# EAGLE design Fortin33 (EAGLE 9.4.2)
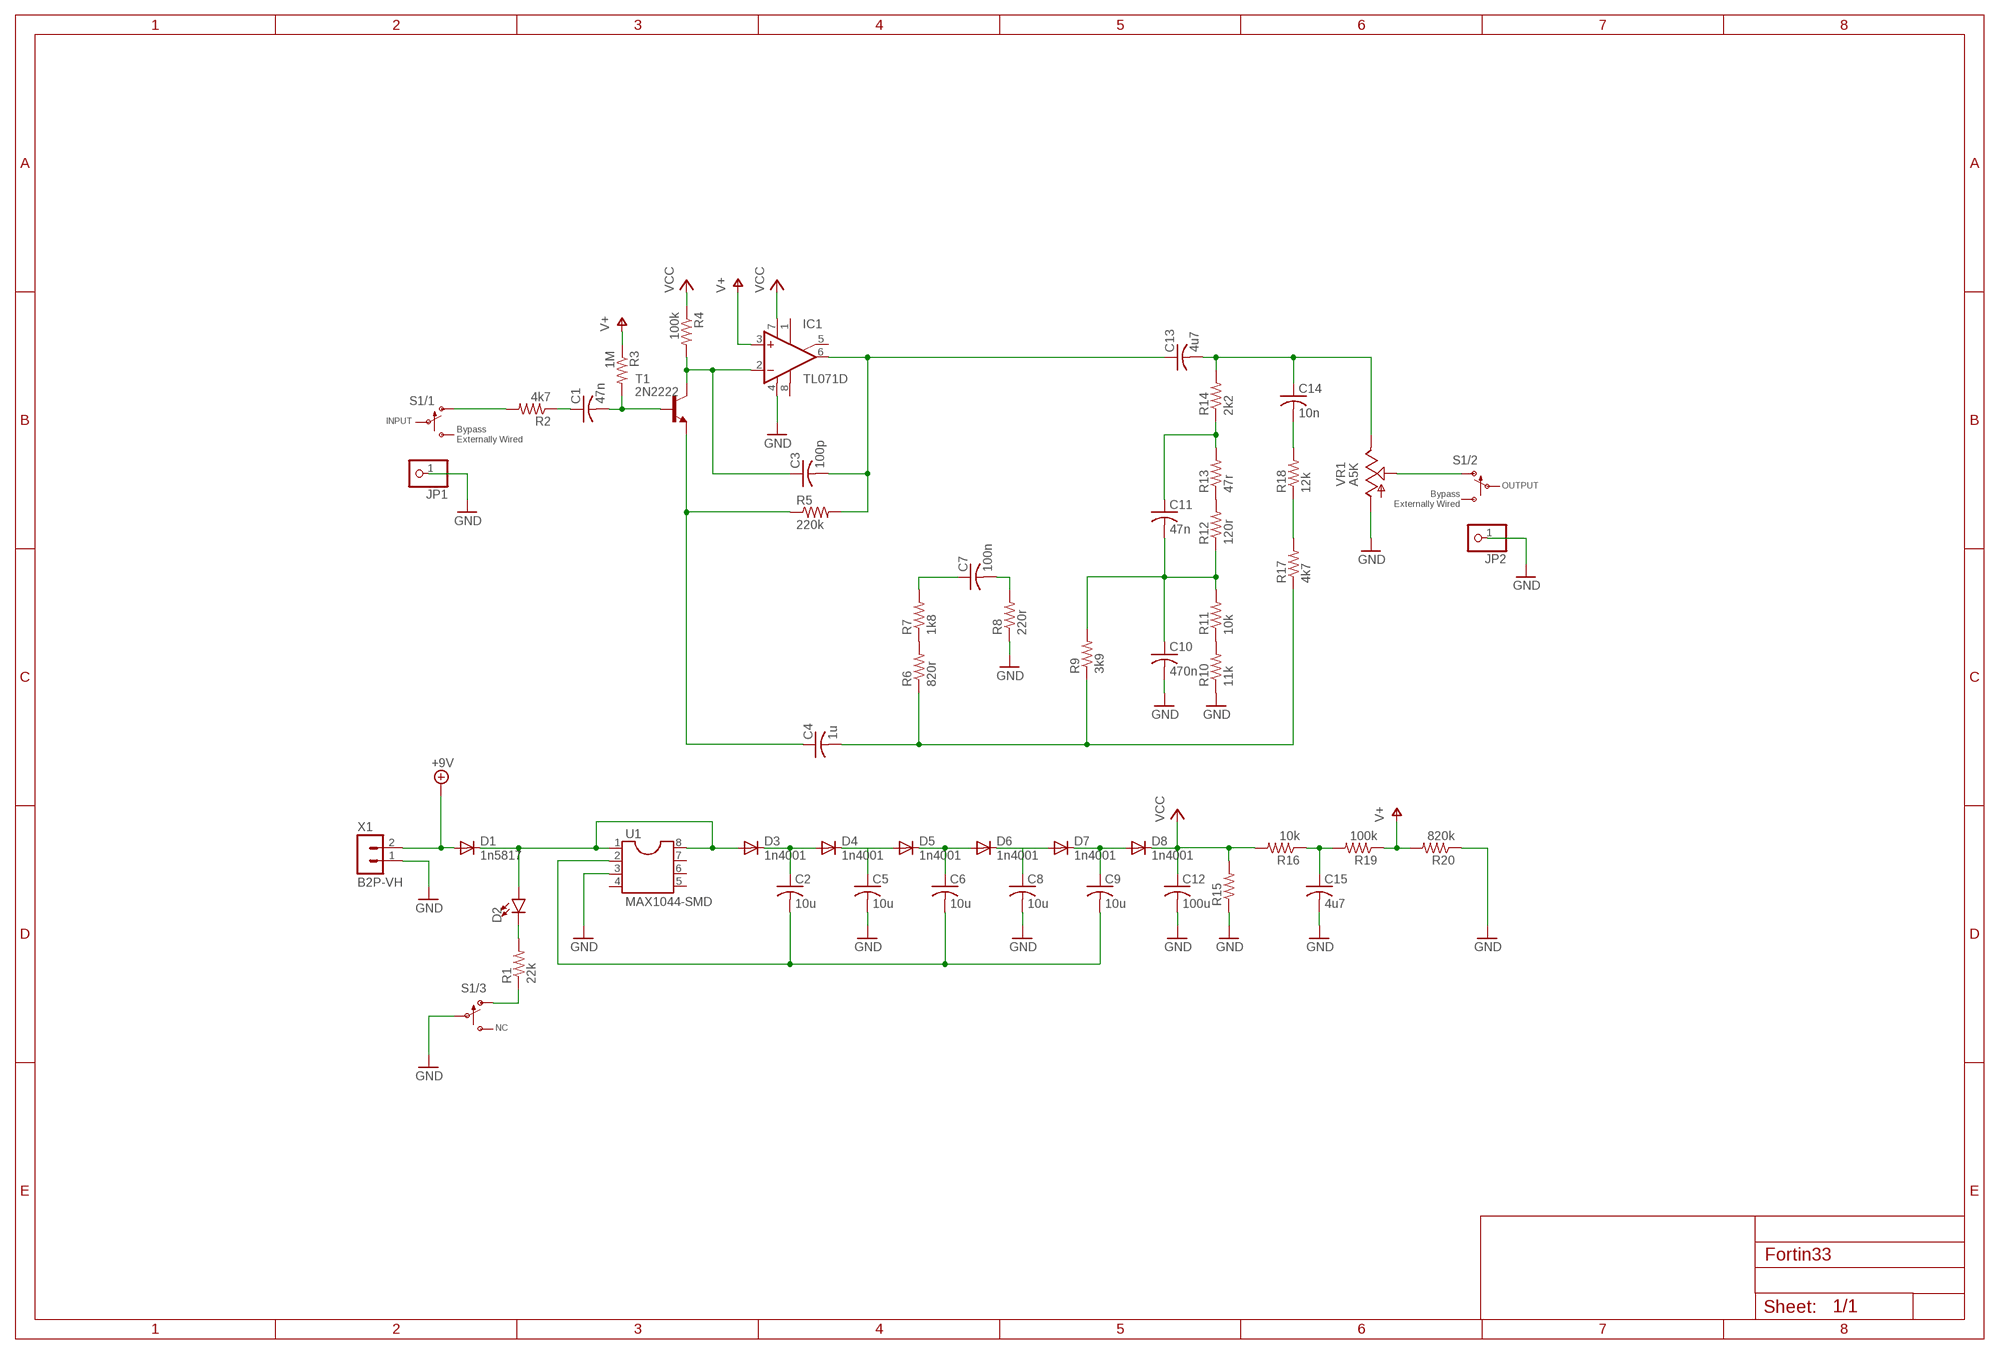
[diagram p0: schematic, sheet 1]

## Parts
C1  47n  C-USC0603  [C0603]
C2  10u  C-US050-025X075  [C050-025X075]
C3  100p  C-USC0603  [C0603]
C4  1u  C-USC0603  [C0603]
C5  10u  C-US050-025X075  [C050-025X075]
C6  10u  C-US050-025X075  [C050-025X075]
C7  100n  C-USC0603  [C0603]
C8  10u  C-US050-025X075  [C050-025X075]
C9  10u  C-US050-025X075  [C050-025X075]
C10  470n  C-USC0603  [C0603]
C11  47n  C-USC0603  [C0603]
C12  100u  C-US075-063X106  [C075-063X106]
C13  4u7  C-USC0603  [C0603]
C14  10n  C-USC0603  [C0603]
C15  4u7  C-US050-025X075  [C050-025X075]
D1  1n5817  1N4004  [DO41-10]
D2  LED3MM  [LED_3MM]
D3  1n4001  1N4004  [DO41-10]
D4  1n4001  1N4004  [DO41-10]
D5  1n4001  1N4004  [DO41-10]
D6  1n4001  1N4004  [DO41-10]
D7  1n4001  1N4004  [DO41-10]
D8  1n4001  1N4004  [DO41-10]
IC1  TL071D  [SO08]
JP1  PINHD-1X1  [1X01]
JP2  PINHD-1X1  [1X01]
R1  22k  R-US_R0603  [R0603]
R2  4k7  R-US_R0603  [R0603]
R3  1M  R-US_R0603  [R0603]
R4  100k  R-US_R0603  [R0603]
R5  220k  R-US_R0603  [R0603]
R6  820r  R-US_R0603  [R0603]
R7  1k8  R-US_R0603  [R0603]
R8  220r  R-US_R0603  [R0603]
R9  3k9  R-US_R0603  [R0603]
R10  11k  R-US_R0603  [R0603]
R11  10k  R-US_R0603  [R0603]
R12  120r  R-US_R0603  [R0603]
R13  47r  R-US_R0603  [R0603]
R14  2k2  R-US_R0603  [R0603]
R15  R-US_R0603  [R0603]
R16  10k  R-US_R0603  [R0603]
R17  4k7  R-US_R0603  [R0603]
R18  12k  R-US_R0603  [R0603]
R19  100k  R-US_R0603  [R0603]
R20  820k  R-US_R0603  [R0603]
S1  SWITCH-3DPT-INLINE-BREAKOUT-BYPASS  [1X04]
T1  2N2222  [TO92-EBC-OVAL]
U1  MAX1044-SMD  [SO-08]
VR1  A5K  16MM-POT  [ALPHA-16-MINI]
X1  B2P-VH  [B2P-VH]

## Nets
+9V: D1.A X1.2
GND: C5.2 C8.2 C10.2 C12.2 C15.2 IC1.4(V-) JP1.1 JP2.1 R8.1 R10.1 R15.1 R20.1 S1.3(/3:COMMON) U1.3 VR1.LEFT X1.1
N$1: S1.2(/2:NORMALLY-ON) VR1.WIPER
N$3: C1.1 R2.1
N$4: R2.2 S1.1(/1:NORMALLY-ON)
N$6: C3.1 IC1.2(-IN) R4.2 T1.C
N$7: C1.2 R3.2 T1.B
N$10: R12.2 R13.1
N$11: C3.2 C13.1 IC1.6(OUT) R5.2
N$12: C4.1 R5.1 T1.E
N$13: C11.1 R13.2 R14.1
N$14: C13.2 C14.1 R14.2 VR1.RIGHT
N$15: C10.1 C11.2 R9.2 R11.2 R12.1
N$16: R10.2 R11.1
N$17: R6.2 R7.1
N$18: C7.1 R7.2
N$19: C7.2 R8.2
N$20: C4.2 R6.1 R9.1 R17.1
N$21: R17.2 R18.1
N$22: C14.2 R18.2
N$24: D1.C D2.A D3.A U1.1 U1.8
N$25: D2.K(C) R1.2
N$26: R1.1 S1.4(/3:NORMALLY-ON)
N$27: C2.2 C6.2 C9.2 U1.2
N$28: C2.1 D3.C D4.A
N$29: C5.1 D4.C D5.A
N$33: C6.1 D5.C D6.A
N$35: C8.1 D6.C D7.A
N$37: C9.1 D7.C D8.A
N$40: C15.1 R16.1 R19.2
V+: IC1.3(+IN) R3.1 R19.1 R20.2
VCC: C12.1 D8.C IC1.7(V+) R4.1 R15.2 R16.2
Unconnected: IC1.1(ON1) IC1.5(ON2) IC1.8(OPT) U1.4 U1.5 U1.6 U1.7

## Library data of the parts
C1-C15 = rcl:C-US: CAPACITOR, American symbol; SPICEPREFIX: C
D1 D3-D8 = adafruit:1N4004: DIODE General purpose 1N400x type rectifier (With bigger pads) http://www.ladyada.net/library/pcb/eaglelibrary.html
D2 = SparkFun-LED:LED: LED (Generic) Standard schematic elements and footprints for 5mm, 3mm, 1206, and 0603 sized LEDs. Generic LEDs with no color specified.; PROD_ID: DIO-08794
IC1 = linear:TL071: OP AMP
JP1 JP2 = adafruit:PINHD-1X1: Pin header 1x1 for 0.1" spacing With round pins
R1-R20 = rcl:R-US_: RESISTOR, American symbol; SPICEPREFIX: R
S1 = pedalPartsLibrary:SWITCH-3DPT-INLINE-BREAKOUT-BYPASS
T1 = adafruit:2N2222: NPN TRANSISTOR Big oval pads
U1 = pedalPartsLibrary:MAX1044-SMD
VR1 = pedalPartsLibrary:16MM-POT
X1 = con-JST VH:B2P-VH: JST VH Series header 3.96mm pitch disconnectable crimp style connectors, vertical (side entry type), 2 pins

## Board
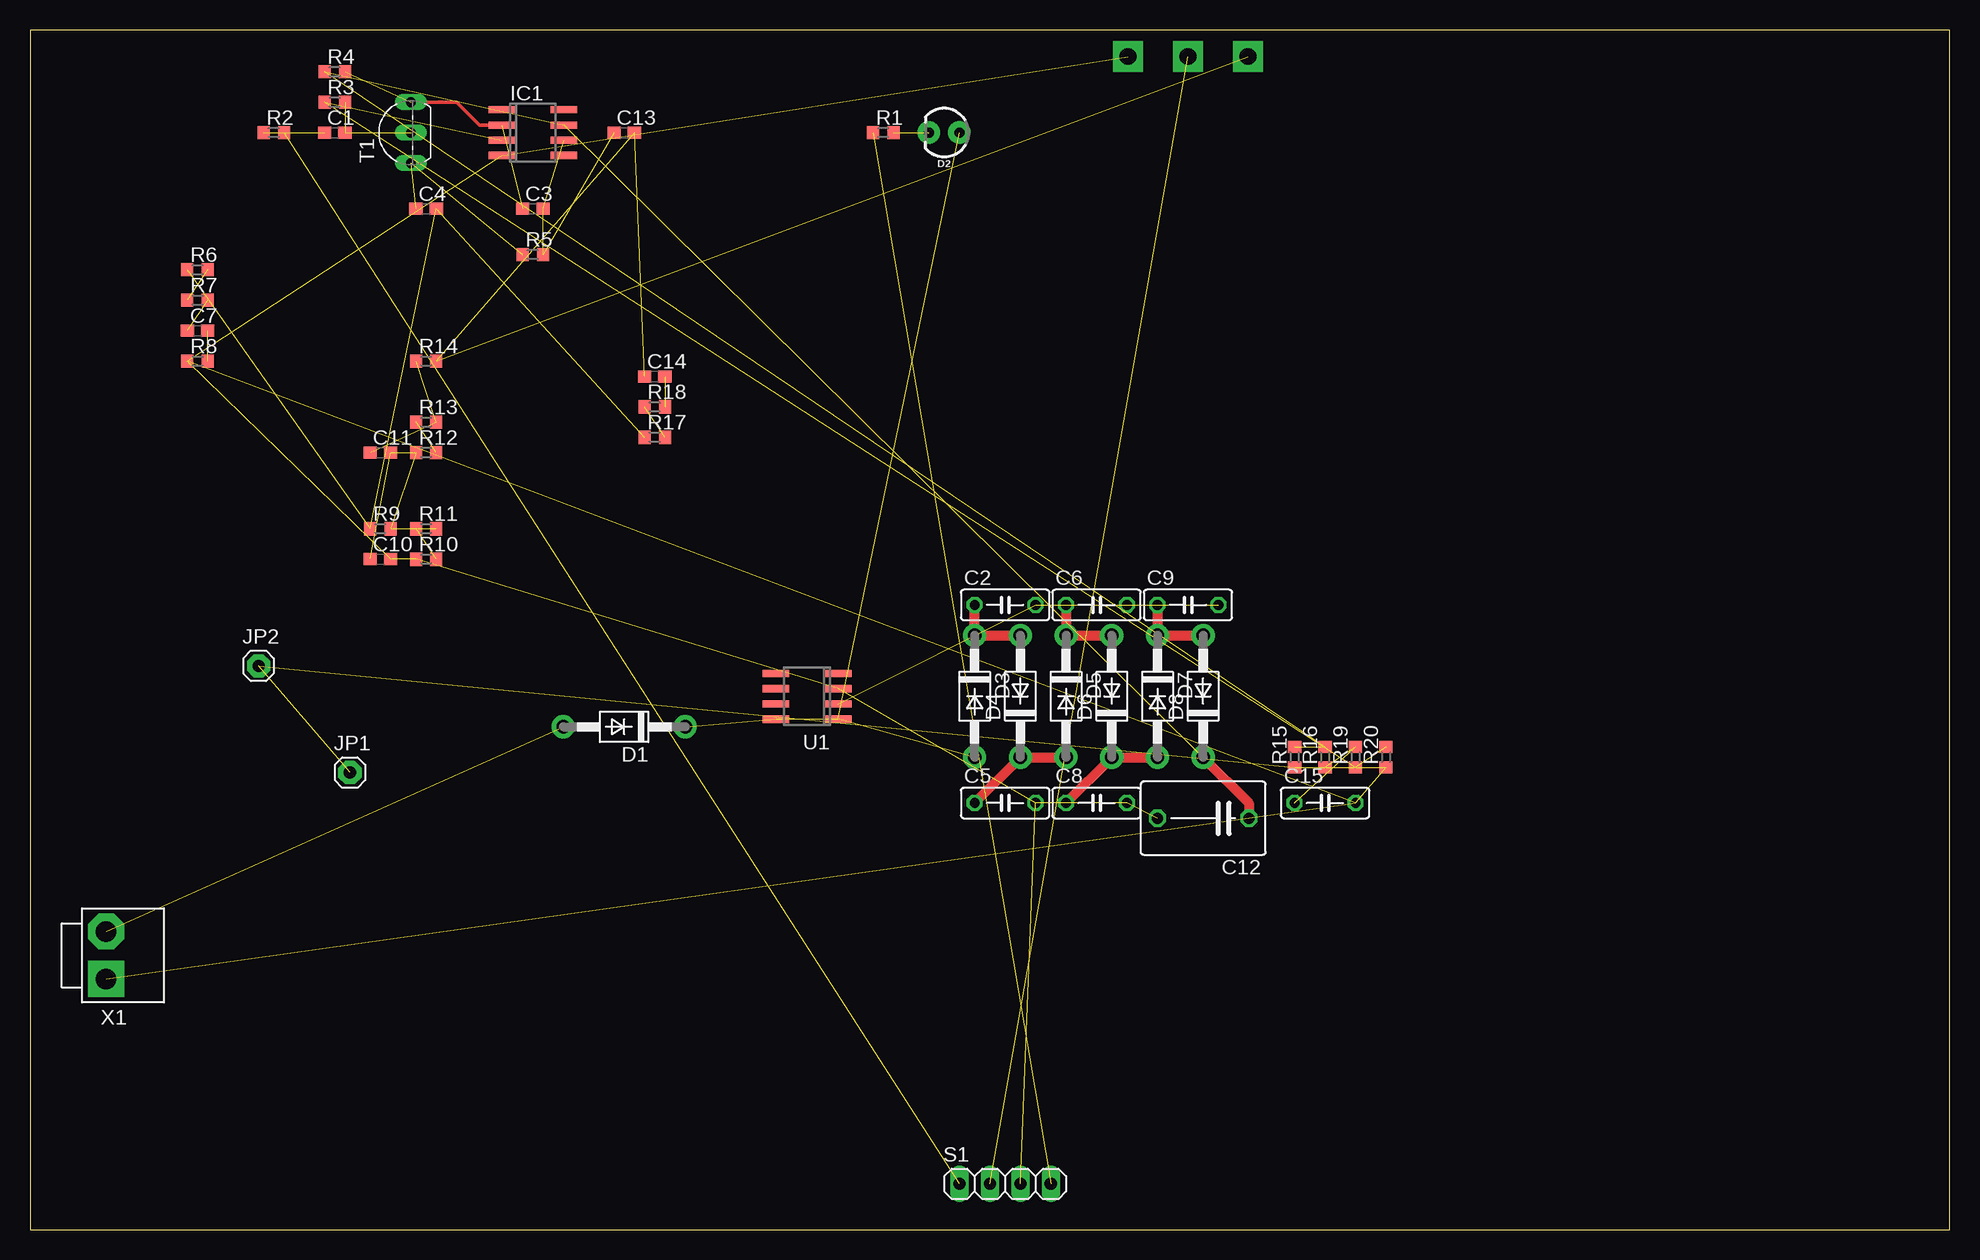
[diagram p1: board, top side]
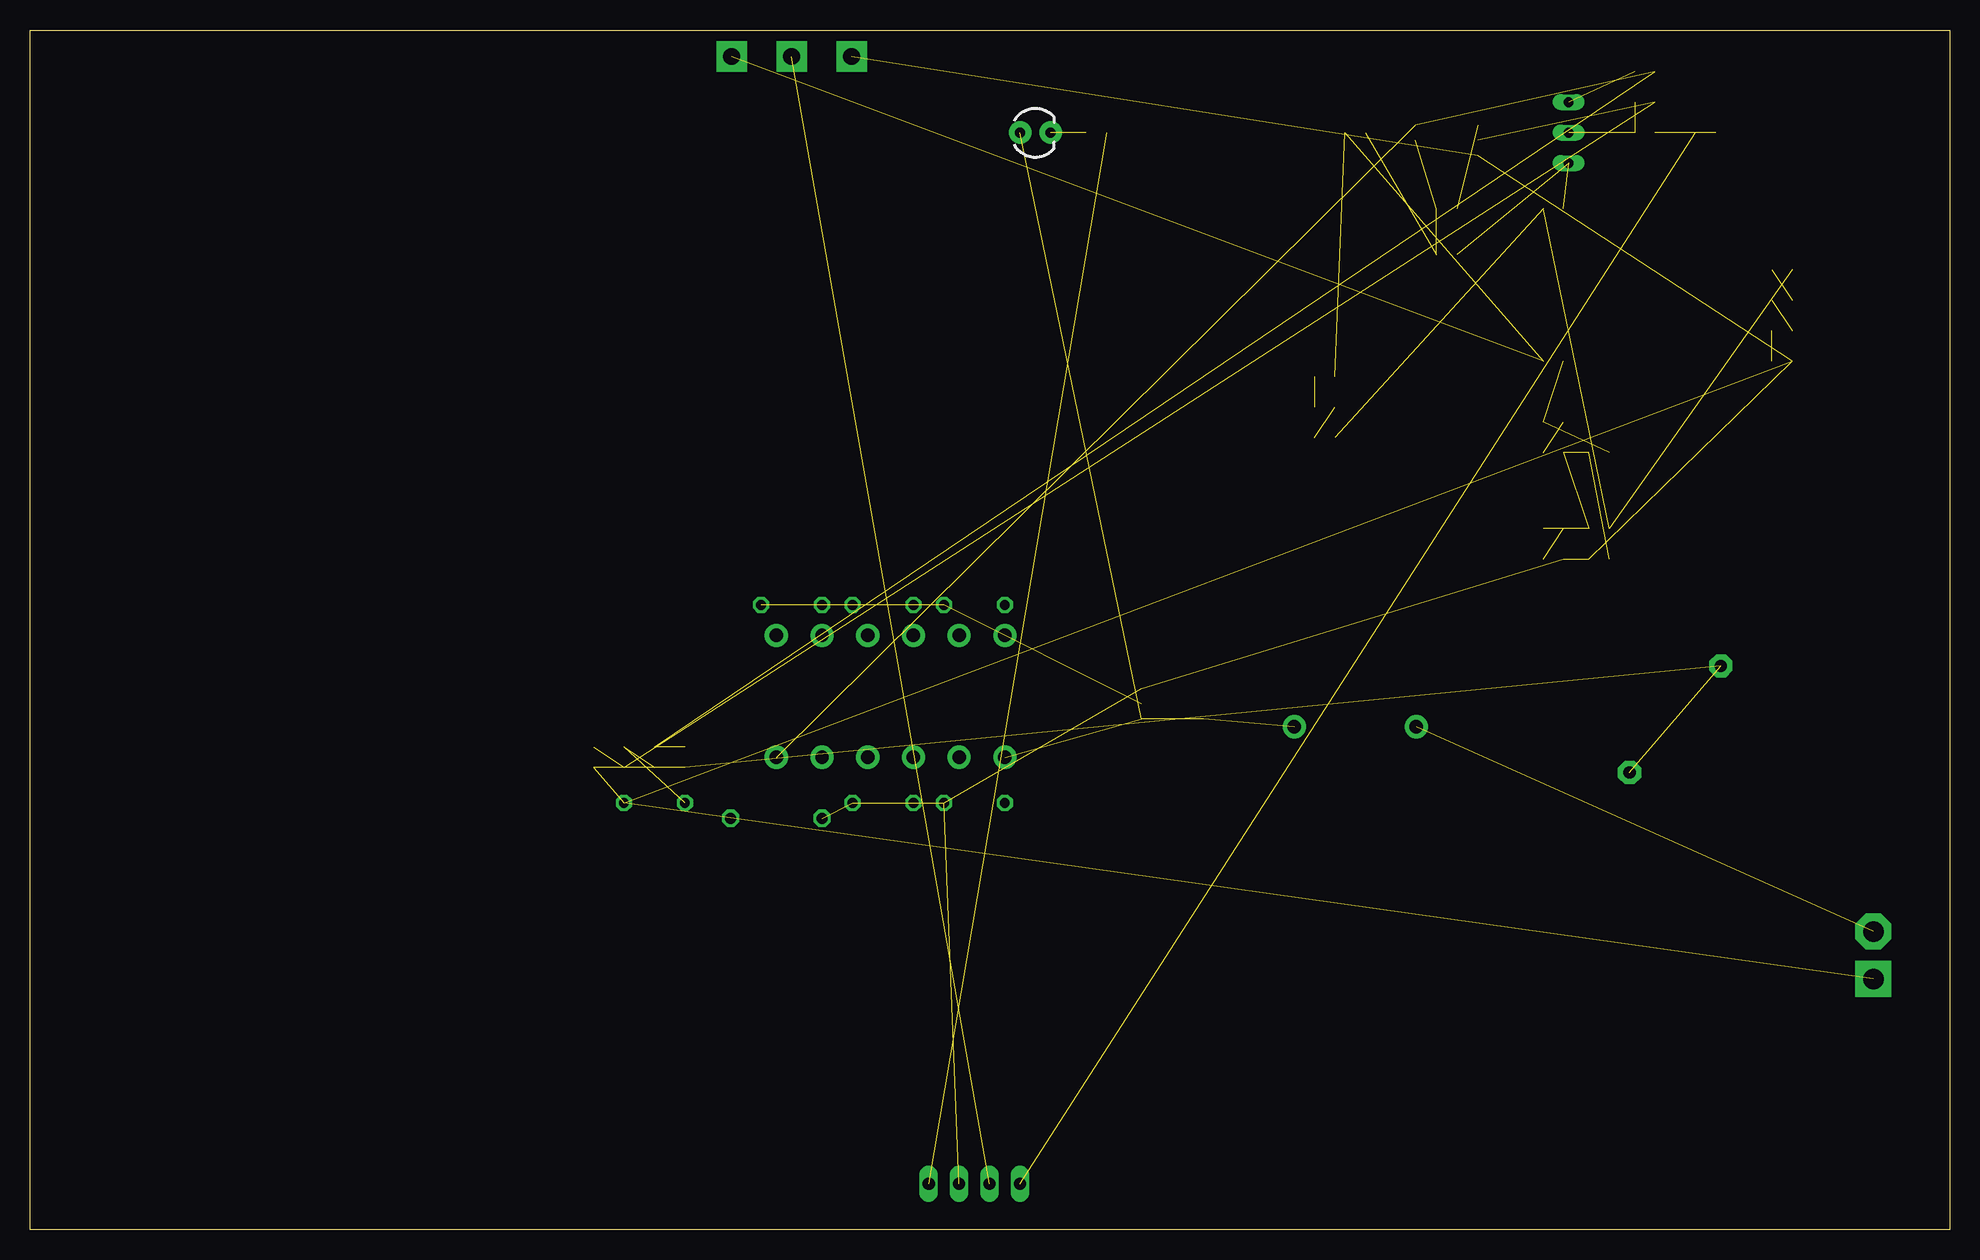
[diagram p2: board, bottom side, seen from below]

Size 160 x 100 mm. Coordinates in mm from the lower left corner, seen from the top.
Outline: 0,0 160,0 160,100 0,100 0,0
Copper layers (1*16): Top 0.035mm / dielectric 1.5mm / Bottom 0.035mm
Design rules "default": minimum track width 6mil, minimum drill 0.35mm, track to track 6mil, track to pad 6mil, pad to pad 6mil, via to via 6mil, smd to smd 6mil, copper to edge 40mil, drill to drill 6mil, minimum pad ring 10mil, minimum via ring 8mil, stop-mask expansion 4mil, vias tented up to drill 0mil, thermal gap 10mil

### Footprints (pad centres in the part's own frame; a part is rotated, then mirrored left to right if it is on the bottom)
C0603 = smd 1.1 x 1: 1 -0.85,0; 2 0.85,0
C050-025X075 = drill 0.813 octagon: 1 -2.54,0; 2 2.54,0
C075-063X106 = drill 0.914 octagon: 1 -3.81,0; 2 3.81,0
DO41-10 = drill 1.118 pad 1.93: A 5.08,0; C -5.08,0
LED_3MM = drill 0.813 pad 1.88: A -1.27,0; K 1.27,0
SO08 = smd 0.6 x 2.2: 1 -1.905,-2.6; 2 -0.635,-2.6; 3 0.635,-2.6; 4 1.905,-2.6; 5 1.905,2.6; 6 0.635,2.6; 7 -0.635,2.6; 8 -1.905,2.6
1X01 = drill 1.016 pad 1.93 octagon: 1 0,0
R0603 = smd 1 x 1.1: 1 -0.85,0; 2 0.85,0
1X04 = drill 1.016 long: 1 -3.81,0; 2 -1.27,0; 3 1.27,0; 4 3.81,0
TO92-EBC-OVAL = drill 0.813 long: B 0,-1.27; C 2.54,-1.27; E -2.54,-1.27
SO-08 = smd 0.6 x 2.2: 1 -1.905,-2.6; 2 -0.635,-2.6; 3 0.635,-2.6; 4 1.905,-2.6; 5 1.905,2.6; 6 0.635,2.6; 7 -0.635,2.6; 8 -1.905,2.6
ALPHA-16-MINI = drill 1.4 pad 2.54 square: LEFT -5,0; RIGHT 5,0; WIPER 0,0
B2P-VH = drill 1.7 pad 3 square: 1 -1.98,0 | drill 1.7 pad 3 octagon: 2 1.98,0

### Placement (x,y rotation side)
C1  25.4,91.44 0 top
C2  81.28,52.07 0 top
C3  41.91,85.09 0 top
C4  33.02,85.09 0 top
C5  81.28,35.56 0 top
C6  88.9,52.07 0 top
C7  13.97,74.93 0 top
C8  88.9,35.56 0 top
C9  96.52,52.07 0 top
C10  29.21,55.88 0 top
C11  29.21,64.77 0 top
C12  97.79,34.29 180 top
C13  49.53,91.44 0 top
C14  52.07,71.12 0 top
C15  107.95,35.56 0 top
D1  49.53,41.91 180 top
D2  76.2,91.44 180 top
D3  78.74,44.45 270 top
D4  82.55,44.45 90 top
D5  86.36,44.45 270 top
D6  90.17,44.45 90 top
D7  93.98,44.45 270 top
D8  97.79,44.45 90 top
IC1  41.91,91.44 270 top
JP1  26.67,38.1 0 top
JP2  19.05,46.99 0 top
R1  71.12,91.44 0 top
R2  20.32,91.44 0 top
R3  25.4,93.98 0 top
R4  25.4,96.52 0 top
R5  41.91,81.28 0 top
R6  13.97,80.01 0 top
R7  13.97,77.47 0 top
R8  13.97,72.39 0 top
R9  29.21,58.42 0 top
R10  33.02,55.88 0 top
R11  33.02,58.42 0 top
R12  33.02,64.77 0 top
R13  33.02,67.31 0 top
R14  33.02,72.39 0 top
R15  105.41,39.37 90 top
R16  107.95,39.37 90 top
R17  52.07,66.04 0 top
R18  52.07,68.58 0 top
R19  110.49,39.37 90 top
R20  113.03,39.37 90 top
S1  81.28,3.81 0 top
T1  30.48,91.44 90 top
U1  64.77,44.45 90 top
VR1  96.52,97.79 0 top
X1  6.35,22.86 90 top

### Tracks (layer width: path | path; a pad name or v marks a point on that pad's centre or on a via)
+9V  (1 unrouted)
GND  (15 unrouted)
N$1  (1 unrouted)
N$3  (1 unrouted)
N$4  (1 unrouted)
N$6  (2 unrouted)
  Top 0.305: T1.C 35.56,93.98 37.47,92.08 IC1.2
N$7  (2 unrouted)
N$10  (1 unrouted)
N$11  (3 unrouted)
N$12  (2 unrouted)
N$13  (2 unrouted)
N$14  (3 unrouted)
N$15  (4 unrouted)
N$16  (1 unrouted)
N$17  (1 unrouted)
N$18  (1 unrouted)
N$19  (1 unrouted)
N$20  (3 unrouted)
N$21  (1 unrouted)
N$22  (1 unrouted)
N$24  (4 unrouted)
N$25  (1 unrouted)
N$26  (1 unrouted)
N$27  (3 unrouted)
N$28
  Top 0.813: D4.A D3.C C2.1
N$29
  Top 0.813: D5.A D4.C C5.1
N$33
  Top 0.813: D6.A D5.C C6.1
N$35
  Top 0.813: D7.A D6.C C8.1
N$37
  Top 0.813: D8.A D7.C C9.1
N$40  (2 unrouted)
V+  (3 unrouted)
VCC  (4 unrouted)
  Top 0.813: D8.C 101.6,35.56 C12.1